# EAGLE design simblee_breakout (EAGLE 7.4.0)
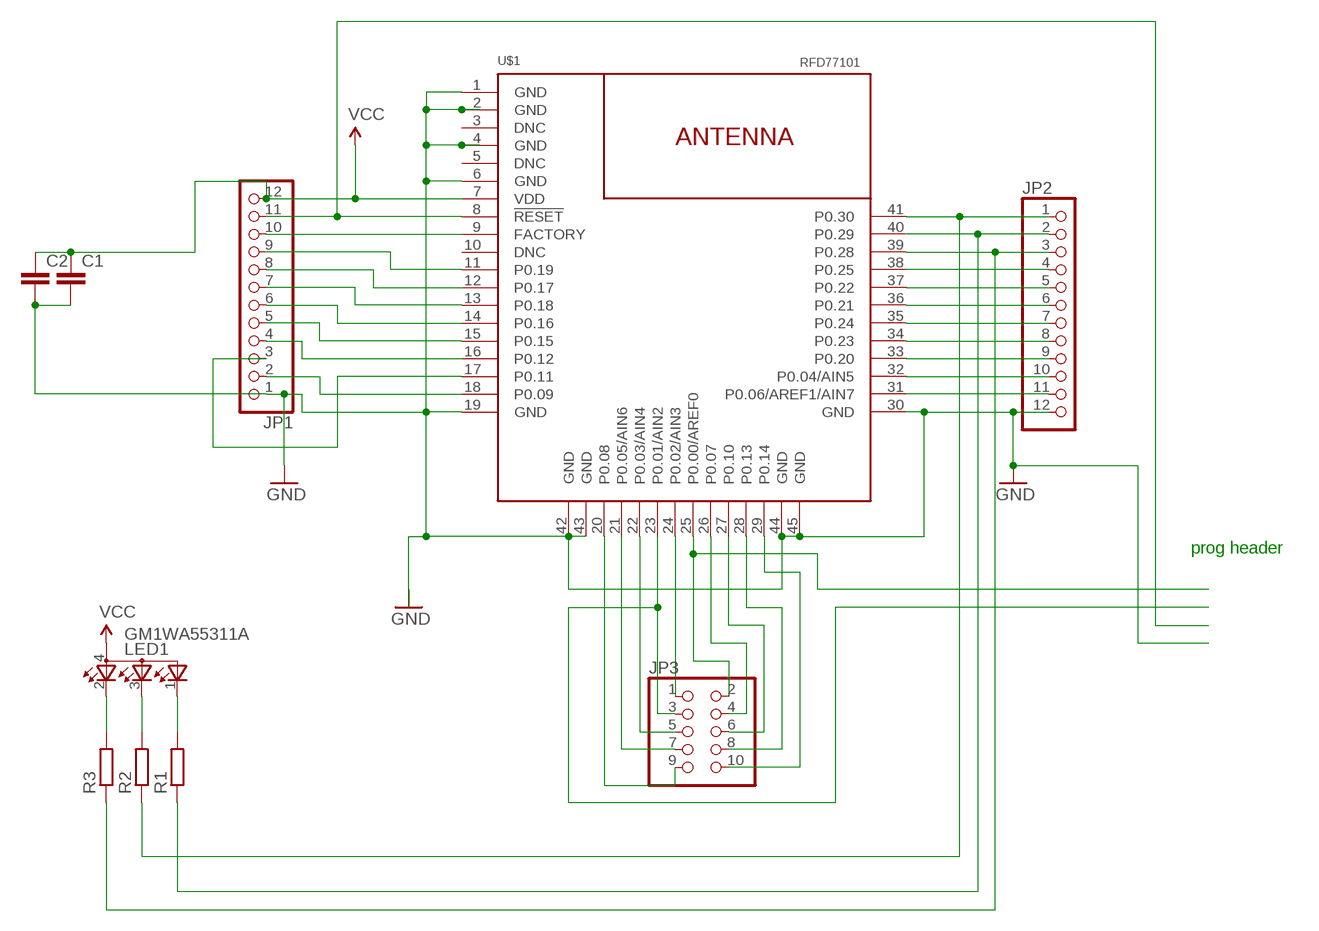
[diagram p0: schematic, sheet 1]

## Parts
C1  C-EUC0603  [C0603]
C2  C-EUC0603  [C0603]
JP1  PINHD-1X12  [1X12]
JP2  PINHD-1X12  [1X12]
JP3  PINHD-2X5  [2X05]
LED1  GM1WA55311A  [GM1WA55311A]
R1  R-EU_R0603  [R0603]
R2  R-EU_R0603  [R0603]
R3  R-EU_R0603  [R0603]
U$1  RFD77101  [RFD77101]

## Nets
GND: C1.2 C2.2 JP1.1 JP2.12 U$1.1(GND) U$1.2(GND) U$1.4(GND) U$1.6(GND) U$1.19(GND) U$1.30(GND) U$1.42(GND) U$1.43(GND) U$1.44(GND) U$1.45(GND)
N$1: JP2.7 U$1.35(P0.24)
N$3: LED1.2(CRED) R3.2
N$4: JP2.11 U$1.31(P0.06/AREF1/AIN7)
N$5: JP1.11 U$1.8(!RESET!)
N$6: JP1.10 U$1.9(FACTORY)
N$7: JP1.9 U$1.11(P0.19)
N$8: JP1.8 U$1.12(P0.17)
N$9: JP1.7 U$1.13(P0.18)
N$10: JP1.6 U$1.14(P0.16)
N$11: JP1.5 U$1.15(P0.15)
N$12: JP1.4 U$1.16(P0.12)
N$13: JP1.3 U$1.17(P0.11)
N$14: JP1.2 U$1.18(P0.09)
N$15: LED1.3(CBLUE) R2.2
N$17: JP2.2 R1.1 U$1.40(P0.29)
N$19: JP2.4 U$1.38(P0.25)
N$20: JP2.5 U$1.37(P0.22)
N$21: JP2.6 U$1.36(P0.21)
N$22: LED1.1(CGREEN) R1.2
N$23: JP2.8 U$1.34(P0.23)
N$24: JP2.9 U$1.33(P0.20)
N$25: JP3.1 U$1.24(P0.02/AIN3)
N$26: JP2.10 U$1.32(P0.04/AIN5)
N$27: JP3.9 U$1.20(P0.08)
N$28: JP3.7 U$1.21(P0.05/AIN6)
N$29: JP2.1 R2.1 U$1.41(P0.30)
N$30: JP3.3 U$1.23(P0.01/AIN2)
N$31: JP2.3 R3.1 U$1.39(P0.28)
N$32: JP3.2 U$1.25(P0.00/AREF0)
N$33: JP3.4 U$1.26(P0.07)
N$34: JP3.6 U$1.27(P0.10)
N$35: JP3.8 U$1.28(P0.13)
N$36: JP3.10 U$1.29(P0.14)
N$38: JP3.5 U$1.22(P0.03/AIN4)
VCC: C1.1 C2.1 JP1.12 LED1.4(A) U$1.7(VDD)
Unconnected: U$1.3(DNC) U$1.5(DNC) U$1.10(DNC)

## Notes on the sheet
- prog header

## Library data of the parts
C1 C2 = rcl:C-EU: CAPACITOR, European symbol
JP1 JP2 = adafruit:PINHD-1X12: PIN HEADER
JP3 = pinhead:PINHD-2X5: PIN HEADER
LED1 = led:GM1WA55311A: Chip LED RGB Source: http://document.sharpsma.com/files/GM1WA55311A_SS.pdf
R1-R3 = rcl:R-EU_: RESISTOR, European symbol
U$1 = RFDigital:RFD77101: Simblee ™ BLE Module RFD77101 © 2015 RF Digital Corporation www.RFDigital.com www.Simblee.com PATENTS PENDING 04.01.2015

## Board
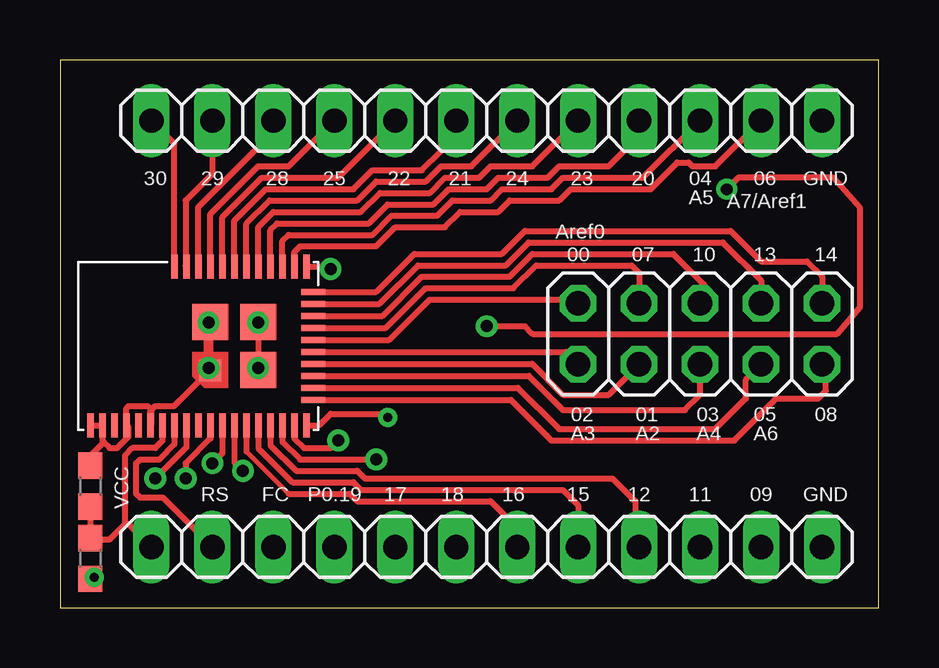
[diagram p1: board, top side]
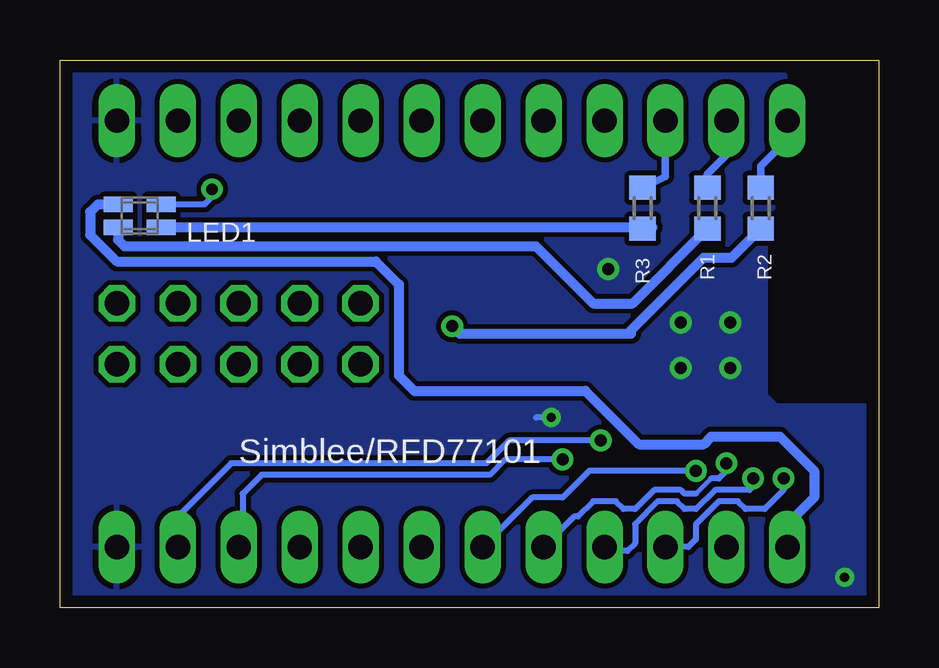
[diagram p2: board, bottom side, seen from below]

Size 34.12 x 22.85 mm. Coordinates in mm from the lower left corner, seen from the top.
Outline: 0,0 34.12,0 34.12,22.85 0,22.85 0,0
Copper layers (1*16): Top 0.035mm / dielectric 1.5mm / Bottom 0.035mm
Design rules "default *": minimum track width 10mil, minimum drill 24mil, track to track 8mil, track to pad 8mil, pad to pad 8mil, via to via 8mil, smd to smd 8mil, copper to edge 20mil, drill to drill 8mil, minimum pad ring 10mil, minimum via ring 8mil, stop-mask expansion 4mil, vias tented up to drill 20mil, thermal gap 10mil

### Footprints (pad centres in the part's own frame; a part is rotated, then mirrored left to right if it is on the bottom)
C0603 = smd 1.1 x 1: 1 -0.85,0; 2 0.85,0
1X12 = drill 1.016 long: 1 -13.97,0; 2 -11.43,0; 3 -8.89,0; 4 -6.35,0; 5 -3.81,0; 6 -1.27,0; 7 1.27,0; 8 3.81,0; 9 6.35,0; 10 8.89,0; 11 11.43,0; 12 13.97,0
2X05 = drill 1.016 octagon: 1 -5.08,-1.27; 2 -5.08,1.27; 3 -2.54,-1.27; 4 -2.54,1.27; 5 0,-1.27; 6 0,1.27; 7 2.54,-1.27; 8 2.54,1.27; 9 5.08,-1.27; 10 5.08,1.27
GM1WA55311A = smd 0.65 x 1.2: 1 -0.475,0.9; 2 -0.475,-0.9; 3 0.475,-0.9; 4 0.475,0.9
R0603 = smd 1 x 1.1: 1 -0.85,0; 2 0.85,0
RFD77101 = smd 1 x 0.254: 1 0,0; 2 0,-0.5; 3 0,-1; 4 0,-1.5; 5 0,-2; 6 0,-2.5; 7 0,-3; 8 0,-3.5; 9 0,-4; 10 0,-4.5; 11 0,-5; 12 0,-5.5; 13 0,-6; 14 0,-6.5; 15 0,-7; 16 0,-7.5; 17 0,-8; 18 0,-8.5; 19 0,-9; 30 6.61,-9; 31 6.61,-8.5; 32 6.61,-8; 33 6.61,-7.5; 34 6.61,-7; 35 6.61,-6.5; 36 6.61,-6; 37 6.61,-5.5; 38 6.61,-5; 39 6.61,-4.5; 40 6.61,-4; 41 6.61,-3.5 | smd 0.254 x 1: 20 1.055,-9.29; 21 1.555,-9.29; 22 2.055,-9.29; 23 2.555,-9.29; 24 3.055,-9.29; 25 3.555,-9.29; 26 4.055,-9.29; 27 4.555,-9.29; 28 5.055,-9.29; 29 5.555,-9.29 | smd 0.9 x 0.9: 42 2.3,-4.99 | smd 1.5 x 1.5: 43 2.3,-6.99; 44 4.3,-6.99; 45 4.3,-4.99

### Placement (x,y rotation side)
C1  1.27,5.08 90 top
C2  1.27,2.06 270 top
JP1  17.78,2.54 180 top
JP2  17.78,20.32 0 top
JP3  26.67,11.43 0 top
LED1  30.8,16.35 90 bottom
R1  7.14,16.67 270 bottom
R2  4.92,16.67 270 bottom
R3  9.84,16.67 270 bottom
U$1  1.27,7.62 90 top

### Tracks (layer width: path | path; a pad name or v marks a point on that pad's centre or on a via)
GND  (via drill 0.38, 0.5)
  Top 0.254: U$1.30 11.17,14.23 v11.27,14.13 | v8.26,11.91 U$1.44 v8.26,10.01 v8.26,10 U$1.43 | v6.19,10 v6.19,9.99 U$1.42 4.75,8.41 3.97,8.41 3.77,8.21 U$1.6 3.81,7.66 3.81,8.26 3.65,8.41 2.86,8.41 2.77,8.33 U$1.4 2.86,7.53 2.86,7.14 2.38,6.67 2.06,6.67 1.83,6.91 | U$1.1 U$1.2 1.77,6.96 1.83,6.91 | C1.2 1.27,6.35 1.83,6.91 | C2.2 1.37,1.21 v1.43,1.27 | U$1.19 10.79,7.62 11.27,8.1 13.49,8.1 v13.65,7.94
  Top 0.406: v6.19,10 6.19,11.85 U$1.45
  Bottom 0.254: v1.43,1.27 1.43,1.43 | v13.65,7.94 14.29,7.94
  other vias: 6.19,11.91
  pour Bottom: -0.48,8.41 -0.48,-0.32 -0.32,-0.48 33.81,-0.48 35.4,1.11 35.4,21.43 33.66,23.18 4.92,23.18 3.02,21.27 3.02,18.1 4.76,16.35 4.76,8.89 4.29,8.41 -0.32,8.41
N$1
  Top 0.254: U$1.35 7.77,16.02 8.73,16.99 12.38,16.99 13.18,17.78 15.24,17.78 15.88,18.41 17.14,18.41 JP2.7
N$3
  Bottom 0.406: LED1.2 9.42,15.88 R3.2
N$4
  Top 0.254: U$1.31 9.77,14.85 10,15.08 13.18,15.08 13.97,15.88 16.03,15.88 16.67,16.51 18.26,16.51 18.73,16.99 20.8,16.99 21.27,17.46 24.61,17.46 25.72,18.57 26.19,18.57 26.35,18.41 27.3,18.41 JP2.11
N$5
  Top 0.254: U$1.8 4.77,6.83 4.13,6.19 3.33,6.19 3.17,6.03 3.17,4.76 3.33,4.6 4.29,4.6 JP1.11
N$6  (via drill 0.5)
  Top 0.254: U$1.9 5.27,6.7 v3.97,5.4
  Bottom 0.254: v3.97,5.4 3.97,4.92 4.76,4.13 5.56,4.13 5.87,4.45 6.67,4.45 7.62,3.49 7.62,2.86 7.94,2.54 JP1.10
N$7  (via drill 0.5)
  Top 0.254: U$1.11 6.27,7.06 5.24,6.03 v5.24,5.4
  Bottom 0.254: v5.24,5.4 5.24,5.08 5.4,4.92 6.83,4.92 7.62,4.13 8.1,4.13 8.41,4.45 9.21,4.45 10.16,3.49 10.16,2.7 10.48,2.38 11.27,2.38 JP1.9
N$8  (via drill 0.5)
  Top 0.254: U$1.12 6.77,6.45 v6.35,6.03
  Bottom 0.178: 6.99,5.4 7.62,4.76
  Bottom 0.254: v6.35,6.03 6.35,5.71 6.67,5.4 6.99,5.4 | 7.62,4.76 8.1,4.76 8.26,4.92 9.37,4.92 10.16,4.13 10.64,4.13 10.95,4.45 11.91,4.45 12.54,3.81 12.7,3.81 JP1.8
N$9  (via drill 0.5)
  Top 0.254: U$1.13 7.27,6.07 v7.62,5.71
  Bottom 0.254: v7.62,5.71 12.06,5.71 13.18,4.6 14.45,4.6 JP1.7
N$10
  Top 0.178: 7.77,6.52 9.53,4.76
  Top 0.254: U$1.14 7.77,6.52 | 9.53,4.76 12.06,4.76 12.38,4.45 17.94,4.45 19.05,3.33 JP1.6
N$11
  Top 0.254: U$1.15 8.27,6.65 9.68,5.24 12.22,5.24 12.54,4.92 20.95,4.92 21.59,4.29 JP1.5
N$12
  Top 0.254: U$1.16 8.77,6.79 9.84,5.71 12.38,5.71 12.7,5.4 23.02,5.4 23.97,4.45 23.97,2.7 JP1.4
N$13  (via drill 0.5)
  Top 0.254: U$1.17 9.27,6.92 10,6.19 v13.18,6.19
  Bottom 0.254: v13.18,6.19 15.56,6.19 16.19,5.56 25.72,5.56 26.51,4.76 26.51,2.7 JP1.3
N$14  (via drill 0.5)
  Top 0.254: U$1.18 9.77,7.06 10.16,6.67 11.27,6.67 v11.59,6.99
  Bottom 0.254: v11.59,6.99 15.4,6.99 16.35,6.03 26.99,6.03 29.05,3.97 29.05,2.7 JP1.2
N$15  (via drill 0.48, 0.5)
  Top 0.254: v17.78,11.75 19.37,11.75 19.68,11.43 32.38,11.43 33.34,12.54 33.34,16.67 32.23,17.94 28.26,17.94 v27.78,17.46
  Bottom 0.254: v27.78,17.46 27.78,17.14 28.1,16.83 LED1.3
  Bottom 0.406: v17.78,11.75 17.46,11.43 10.32,11.43 10.32,11.59 7.3,14.61 6.13,14.61 R2.2
N$17
  Top 0.254: JP2.2 6.35,18.1 5.24,16.99 5.24,14.26 U$1.40
  Bottom 0.305: R1.1 7.14,18.1 6.35,18.89 JP2.2
N$19
  Top 0.254: U$1.38 6.27,16.43 8.26,18.41 9.53,18.41 JP2.4
N$20
  Top 0.254: U$1.37 6.77,16.3 8.41,17.94 11.59,17.94 JP2.5
N$21
  Top 0.254: U$1.36 7.27,16.16 8.57,17.46 12.22,17.46 13.02,18.26 15.08,18.26 15.88,19.05 15.88,19.68 JP2.6
N$22
  Bottom 0.406: LED1.1 31.7,15.35 31.43,15.08 14.29,15.08 11.91,12.7 10.26,12.7 R1.2
N$23
  Top 0.254: U$1.34 8.27,15.89 8.89,16.51 12.54,16.51 13.34,17.3 15.4,17.3 16.03,17.94 17.46,17.94 17.94,18.41 19.68,18.41 JP2.8
N$24
  Top 0.254: U$1.33 8.77,15.76 9.05,16.03 12.86,16.03 13.65,16.83 15.56,16.83 16.19,17.46 17.78,17.46 18.26,17.94 20.32,17.94 20.8,18.41 22.86,18.41 24.13,19.68 JP2.9
N$25
  Top 0.254: U$1.24 21.07,10.68 JP3.1
N$26
  Top 0.254: U$1.32 9.27,15.3 9.53,15.56 13.02,15.56 13.81,16.35 15.72,16.35 16.35,16.99 17.94,16.99 18.41,17.46 20.48,17.46 20.95,17.94 24.29,17.94 JP2.10
N$27
  Top 0.254: JP3.9 31.91,10 31.91,9.05 31.59,8.73 29.84,8.73 28.1,6.99 20.48,6.99 18.79,8.68 U$1.20
N$28
  Top 0.254: U$1.21 19.08,9.18 20.8,7.46 27.3,7.46 28.57,8.73 28.57,9.53 JP3.7
N$29
  Top 0.254: U$1.41 4.77,19.36 JP2.1
  Bottom 0.305: R2.1 4.92,18.41 3.81,19.53 JP2.1
N$30
  Top 0.254: U$1.23 19.67,10.18 20.95,8.89 22.86,8.89 JP3.3
N$31
  Top 0.254: U$1.39 5.77,16.72 8.41,19.37
  Top 0.305: 8.41,19.37 8.41,19.84 JP2.3
  Bottom 0.305: JP2.3 8.89,18 R3.1
N$32
  Top 0.254: U$1.25 13.71,11.18 15.4,12.86 21.43,12.86 JP3.2
N$33
  Top 0.254: U$1.26 13.58,11.68 15.24,13.34 18.89,13.34 19.84,14.29 23.81,14.29 24.13,13.97 JP3.4
N$34
  Top 0.254: U$1.27 13.45,12.18 15.08,13.81 18.73,13.81 19.68,14.76 25.56,14.76 26.83,13.49 26.83,12.86 JP3.6
N$35
  Top 0.254: U$1.28 13.31,12.68 14.92,14.29 18.57,14.29 19.53,15.24 27.62,15.24 29.21,13.65 JP3.8
N$36
  Top 0.254: U$1.29 13.18,13.18 14.76,14.76 18.41,14.76 19.37,15.72 27.94,15.72 29.21,14.45 31.11,14.45 31.75,13.81 JP3.10
N$38
  Top 0.254: U$1.22 19.54,9.68 20.95,8.26 26.04,8.26 26.67,8.89 JP3.5
VCC
  Top 0.254: U$1.7 4.27,6.97 3.97,6.67 3.02,6.67 2.7,6.35 2.7,3.49 | 2.7,3.49 2.86,3.49 JP1.12 | 2.7,3.49 2.06,2.86 1.27,2.86 C2.1 C1.1
  Bottom 0.406: LED1.4 32.55,16.83 32.86,16.51 32.86,15.56 31.75,14.45 20.95,14.45 20,13.49 20,9.68 19.37,9.05 12.22,9.05 10,6.83 7.3,6.83 6.99,7.14 4.13,7.14 2.7,5.71 2.7,4.6 3.65,3.65 3.65,2.7 JP1.12

### Text on the board
tPlace: 30 | 29 | 28 | 25 | 22 | 21 | 24 | 23 | 20 | 04 | 06 | GND | A5 | A7/Aref1 | Aref0 | 00 | 07 | 10 | 13 | 14 | 02 | 01 | 03 | 05 | 08 | A3 | A2 | A4 | A6 | VCC | RS | FC | P0.19 | 17 | 18 | 16 | 15 | 12 | 11 | 09 | GND
bPlace: Simblee/RFD77101